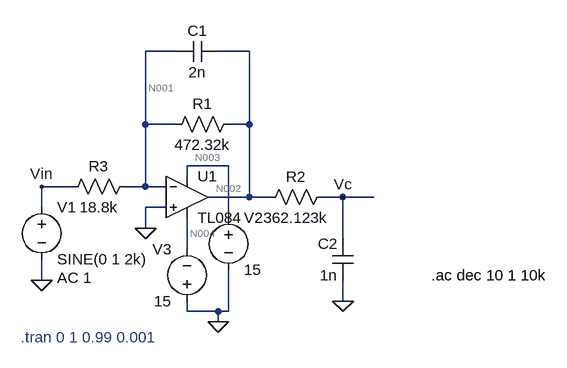
[diagram p0: schematic Low_pass.asc]
* Low_pass.asc
R1 N002 N001 472.32k
R2 Vc N002 362.123k
R3 N001 Vin 18.8k
C1 N002 N001 2n
C2 0 Vc 1n
* U1: TL084 (symbol TL084 not available, pins judged from their places): In+=0 In-=N001 V+=N003 V-=N004 OUT=N002
V1 Vin 0 SINE(0 1 2k) AC 1
V2 N003 0 15
V3 0 N004 15
* .tran 0 1 0.99 0.001
.ac dec 10 1 10k
.backanno
.end

* Results of the author's LTspice run, read from the files saved beside the schematic
* Operating Point, zero values left out:
*   V(n002) = 307.8 µV
*   V(n001) = 10.97 µV
*   V(vc) = 307.8 µV
*   V(n004) = -15 V
*   V(n003) = 15 V
*   I(R1) = 628.5 pA
*   I(R3) = 583.5 pA
*   I(V1) = 583.5 pA
*   I(V2) = -14.19 mA
*   I(V3) = -14.19 mA
*   Ix(u1:1) = 45.05 pA
*   Ix(u1:2) = 45.05 pA
*   Ix(u1:3) = 14.19 mA
*   Ix(u1:4) = -14.19 mA
*   Ix(u1:5) = -628.5 pA
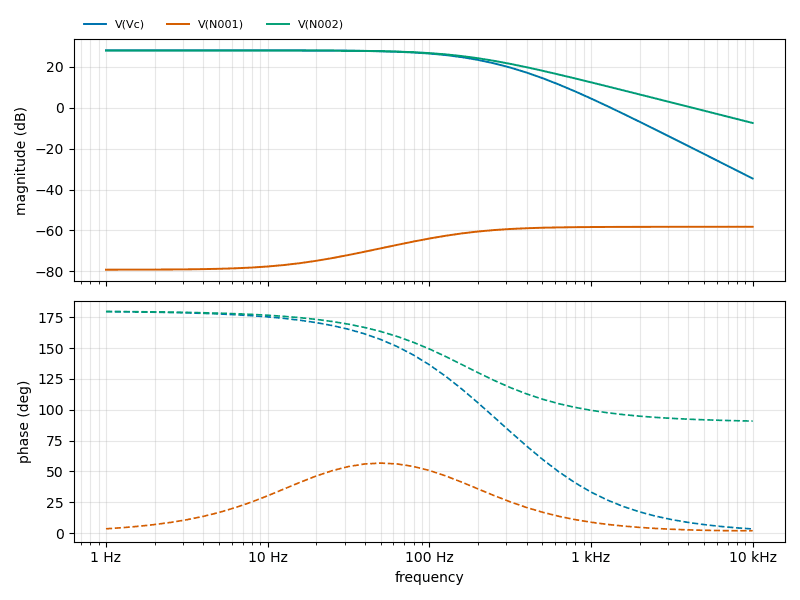
[diagram p1: AC Analysis of Low_pass.asc, plotted from the saved traces]
* AC Analysis, 1 run:
*   V(Vc): 28.00 dB at 1 Hz, -34.63 dB at 10 kHz, peak 28.00 dB at 1 Hz, 3 dB below the peak at 148.8 Hz
*   V(N001): -79.19 dB at 1 Hz, -58.22 dB at 10 kHz, peak -58.22 dB at 10 kHz, 3 dB below the peak at 167.9 Hz
*   V(N002): 28.00 dB at 1 Hz, -7.48 dB at 10 kHz, peak 28.00 dB at 1 Hz, 3 dB below the peak at 167.5 Hz